# Altium schematic sheet Schematic.SchDoc
size A4; SheetNumber: 1; SheetTotal: 1
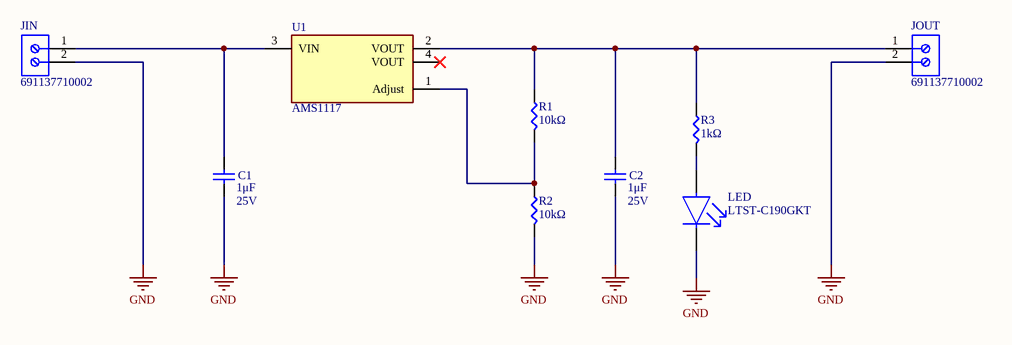
[diagram p0: Schematic.SchDoc]

## Parts
C1  value 1μF  Voltage Rating: 25V  [CAP0805]  (hidden comment: GCM21BR71E105KA56L)
C2  value 1μF  Voltage Rating: 25V  [CAP0805]  (hidden comment: GCM21BR71E105KA56L)
JIN  691137710002  [691137710002]
JOUT  691137710002  [691137710002]
LED  LTST-C190GKT  [FP-LTST-C190GKT-MFG]
R1  value 10kΩ  [RES0603]  (hidden comment: RNCP0603FTD10K0)
R2  value 10kΩ  [RES0603]  (hidden comment: RNCP0603FTD10K0)
R3  value 1kΩ  [RES0603]  (hidden comment: RNCP0603FTD10K0)
U1  AMS1117  [FP-ams1117-IPC_C]

## Nets
GND: C1.1 C2.1 JIN.2 JOUT.2 LED.1(C) R2.1
NetC1_2: C1.2 JIN.1 U1.3(VIN)
NetC2_2: C2.2 JOUT.1 R1.2 R3.2 U1.2(VOUT)
NetLED_2: LED.2(A) R3.1
NetR1_1: R1.1 R2.2 U1.1(Adjust)

Not connected (* = marked no-connect by the designer): U1 4(VOUT)*

## Library data of the parts
C1 C2 = GCM21BR71E105KA56L: CAP CER 1UF 25V X7R 0805; Manufacturer 1: Murata; Supplier 1: Digi-Key; Manufacturer Part Number 1: GCM21BR71E105KA56L; Supplier Part Number 1: 490-4785-1-ND
JIN JOUT = CMP-1502-03324-2: NexarPartId: 78871135; Voltage Rating: 300V; Number of Contacts: 2; Current Rating: 16A; Lead Pitch: 5mm; Height: 11.6mm; Packaging: Box; RoHS: Non-Compliant; Contact Material: Nickel, Tin; Max Operating Temperature: 120°C; Number of Pins: 2; Min Operating Temperature: -30°C; Number of Rows: 1
LED = CMP-22017-000005-2: LED GREEN CLEAR CHIP SMD; Dominant Wavelength: 569nm; Reverse Voltage: 5V; Lens Color: Colorless; Viewing Angle: 130°; Voltage: 2V; Forward Current: 30mA; Power Dissipation: 100mW; Luminous Intensity: 6mcd; Number of LEDs: 1; Forward Voltage: 2.1V; Wavelength: 565nm; Test Current: 10mA; Min Operating Temperature: -55°C; Lens Style: Clear; Mount: Surface Mount; Width: 0.8mm; Packaging: Tape and Reel; Lens Transparency: Clear; Case Code (Metric): 1608; Depth: 0.8mm; Case Code (Imperial): 0603; Case/Package: 0603; Number of Pins: 2; Max Operating Temperature: 85°C; Lead Free: Lead Free; Number of Elements: 1; Length: 1.6mm; Height: 0.8mm; Package Quantity: 1; Power Rating: 100mW; Radiation Hardening: No; Illumination Color: Green; Color: Green
R1-R3 = RNCP0603FTD10K0: RES 10K OHM 1% 1/8W 0603; Manufacturer 1: Stackpole Electronics Inc; Manufacturer Part Number 1: RNCP0603FTD10K0; Supplier Part Number 1: RNCP0603FTD10K0CT-ND; Supplier 1: Digi-Key; Power Rating: 1/8W
U1 = CMP-209535-000002-1: 1A LOW DROPOUT VOLTAGE REGULATOR; RoHS Compliant: Yes